# Altium schematic sheet Smartfin Main PCBA GPS.SchDoc: GPS
size Tabloid; TOCFontName: Consolas; TOCFontSize: 24; TOCFontColor: 0; TOCFontAttributes: 0; TOCMaxLinesInTable: 25; TOCVerticalOffset: 200; TOCHorizontalOffset: 500; TOCHorizontalSeparation: 800; TOCVerticalSeparation: 30; TOCHorizTableSize: 640; Engineer: Amy Domino; DocumentNumber: 644-001-023; Revision: A; SheetNumber: 5; SheetTotal: 9; PageSetup: Record=PageOptions|CenterHorizontal=True|CenterVertical=True|PrintScale=0.96|XCorrection=1.00|YCorrection=1.00|PrintKind=0|BorderSize=5000000|LeftOffset=0|BottomOffset=0|Orientation=2|PaperLength=1000|PaperWidth=1000|Scale=100|PaperSource=7|PrintQuality=-4|MediaType=1|DitherType=10|PaperKind=11" x 17"|PrintScaleMode=1
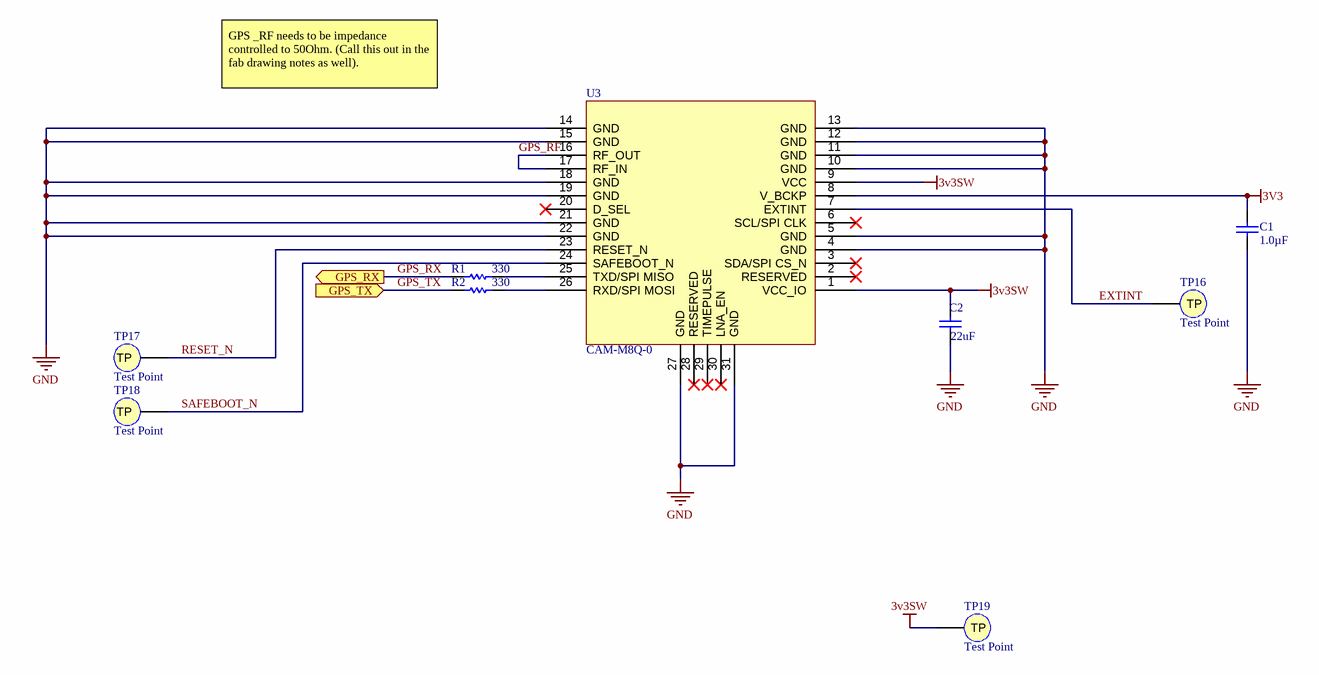
[diagram p0: Smartfin Main PCBA GPS.SchDoc]

## Parts
C1  1.0µF  [CAPC0402(1005)60_N]
C2  22uF  [CAPC0603(1608)100_N]
R1  330  [RESC1005X04N]
R2  330  [RESC1005X04N]
TP16  Test Point  [TESTPAD_ICT]  (no BOM)
TP17  Test Point  [TESTPAD_ICT]  (no BOM)
TP18  Test Point  [TESTPAD_ICT]  (no BOM)
TP19  Test Point  [TESTPAD_ICT]  (no BOM)
U3  CAM-M8Q-0  [CAM-M8Q-0-Footprint-1]

## Ports
GPS_RX (out), GPS_TX (in)

## Nets
3V3: C1.2 U3.8(V_BCKP)
3v3SW: C2.2 TP19.1(TP) U3.1(VCC_IO) U3.9(VCC)
GND: C1.1 C2.1 U3.4(GND) U3.5(GND) U3.10(GND) U3.11(GND) U3.12(GND) U3.13(GND) U3.14(GND) U3.15(GND) U3.18(GND) U3.19(GND) U3.21(GND) U3.22(GND) U3.27(GND) U3.31(GND)
EXTINT: TP16.1(TP) U3.7(EXTINT)
GPS_RF: U3.16(RF_OUT) U3.17(RF_IN)
GPS_RX: R1.1 ; port GPS_RX
GPS_TX: R2.1 ; port GPS_TX
RESET_N: TP17.1(TP) U3.23(RESET_N)
SAFEBOOT_N: TP18.1(TP) U3.24(SAFEBOOT_N)
NetR1_2: R1.2 U3.25(TXD/SPI_MISO)
NetR2_2: R2.2 U3.26(RXD/SPI_MOSI)

Not connected (* = marked no-connect by the designer): U3 2(RESERVED)* 3(SDA/SPI_CS_N)* 6(SCL/SPI_CLK)* 20(D_SEL)* 28(RESERVED)* 29(TIMEPULSE)* 30(LNA_EN)*

## Notes on the sheet
- GPS _RF needs to be impedance controlled to 50Ohm. (Call this out in the fab drawing notes as well).
- TITLE
- DOC NUMBER
- VARIANT
- REV
- 10875 dover st, suite 500
  westminster, co, 80021, usa
  syncroness.com
- FILE
- ENGINEER
- SHEET
- DATE
- OF
- THIS DOCUMENT IS CONFIDENTIAL AND THE PROPERTY OF SYNCRONESS, INC. AND ITS SUBSIDARIES. IT SHALL NOT BE REPRODUCED IN ANY MANNER NOR USED FOR ANY PURPOSE WHATSOEVER EXCEPT AS SPECIFIED IN WRITING BY SYNCRONESS, INC.

## Library data of the parts
C1 = CMP-13694-A.6: CAP CER 1UF 10V 10% X5R 0402; Manufacturer: Yageo; Manufacturer Part Number: CC0402KRX5R6BB105; Manufacturer 2: Samsung Electro-Mechanics; Manufacturer 3: AVX Corporation; Manufacturer Part Number 2: CL05A105KP5NNNC; Manufacturer Part Number 3: 0402ZD105KAT2A; Operating Temperature: -55°C ~ 85°C; Supplier Part Number 1: 311-1439-1-ND; Supplier Part Number 2: 1276-1076-1-ND; Supplier Part Number 3: 478-4596-1-ND; Temperature Coefficient: X5R; Tolerance: ±10%; Capacitance: 1.0µF; Voltage - Rated: 10V; Supplier 2: Digi-Key; Supplier 3: Digi-Key; Supplier 1: Digi-Key; Datasheet: http://www.samsungsem.com/kr/support/product-search/mlcc/__icsFiles/afieldfile/2019/05/10/19-CL05A105KP5NNNC.pdf
C2 = CMP-23693-A.2: CAP CER 22UF 10V X5R 0603; Manufacturer: Murata Electronics; Manufacturer Part Number: GRM188R61A226ME15D; Tolerance: 20%; Case/Package: 0603; Case Code (Metric): 1608; Case Code (Imperial): 0603; Capacitance: 22uF; Voltage Rating: 10V; Dielectric: X5R; Height: 1mm; Width: 0.8mm; Manufacturer 2: Samsung Electro-Mechanics; Manufacturer 3: TDK Corporation; Manufacturer Part Number 2: CL10A226MPCNUBE; Manufacturer Part Number 3: C1608X5R1A226M080AC; Operating Temperature: -55°C ~ 85°C; Supplier 1: Digi-Key; Supplier 2: Digi-Key; Supplier 3: Digi-Key; Supplier Part Number 1: 490-10476-1-ND; Supplier Part Number 2: 1276-6504-1-ND; Supplier Part Number 3: 445-9077-1-ND
R1 R2 = CMP-22585-A.1: RES SMD 330 OHM 1% 1/16W 0402; Manufacturer: Vishay Dale; Manufacturer Part Number: CRCW0402330RFKED; Power (Watts): 0.063W, 1/16W; Temperature Coefficient: ±100ppm/°C; Resistance: 330 Ohms; ComponentLink1Description: Datasheet; ComponentLink1URL: http://www.vishay.com/docs/20035/dcrcwe3.pdf; Composition: Thick Film; Features: AEC-Q200; Height - Seated (Max): 0.016" (0.40mm); Operating Temperature: -55°C ~ 155°C; Package / Case: 0402 (1005 Metric); Size / Dimension: 0.039" L x 0.020" W (1.00mm x 0.50mm); Supplier: Digi-Key; Supplier Part Number: 541-330LCT-ND; Tolerance: ±1%
TP16-TP19 = CMP-08242-A.3: ICT Test Point
U3 = CMP-23691-A.8: RF RCVR GNSS/GPS 1.575GHZ MODULE; Manufacturer: U-Blox; Interface: SPI,UART; Sensitivity: -167dBm; Current - Receiving: 29mA; Case/Package: SMD/SMT; Min Operating Temperature: -40°C; Max Operating Temperature: 85°C; Packaging: Tape and Reel; Frequency: 1.575GHz; Manufacturer Part Number: CAM-M8Q-0; Supplier: Digi-Key; Supplier Part Number: 672-CAM-M8Q-0-10CT-ND